# EAGLE design ch340g (EAGLE 9.6.2)
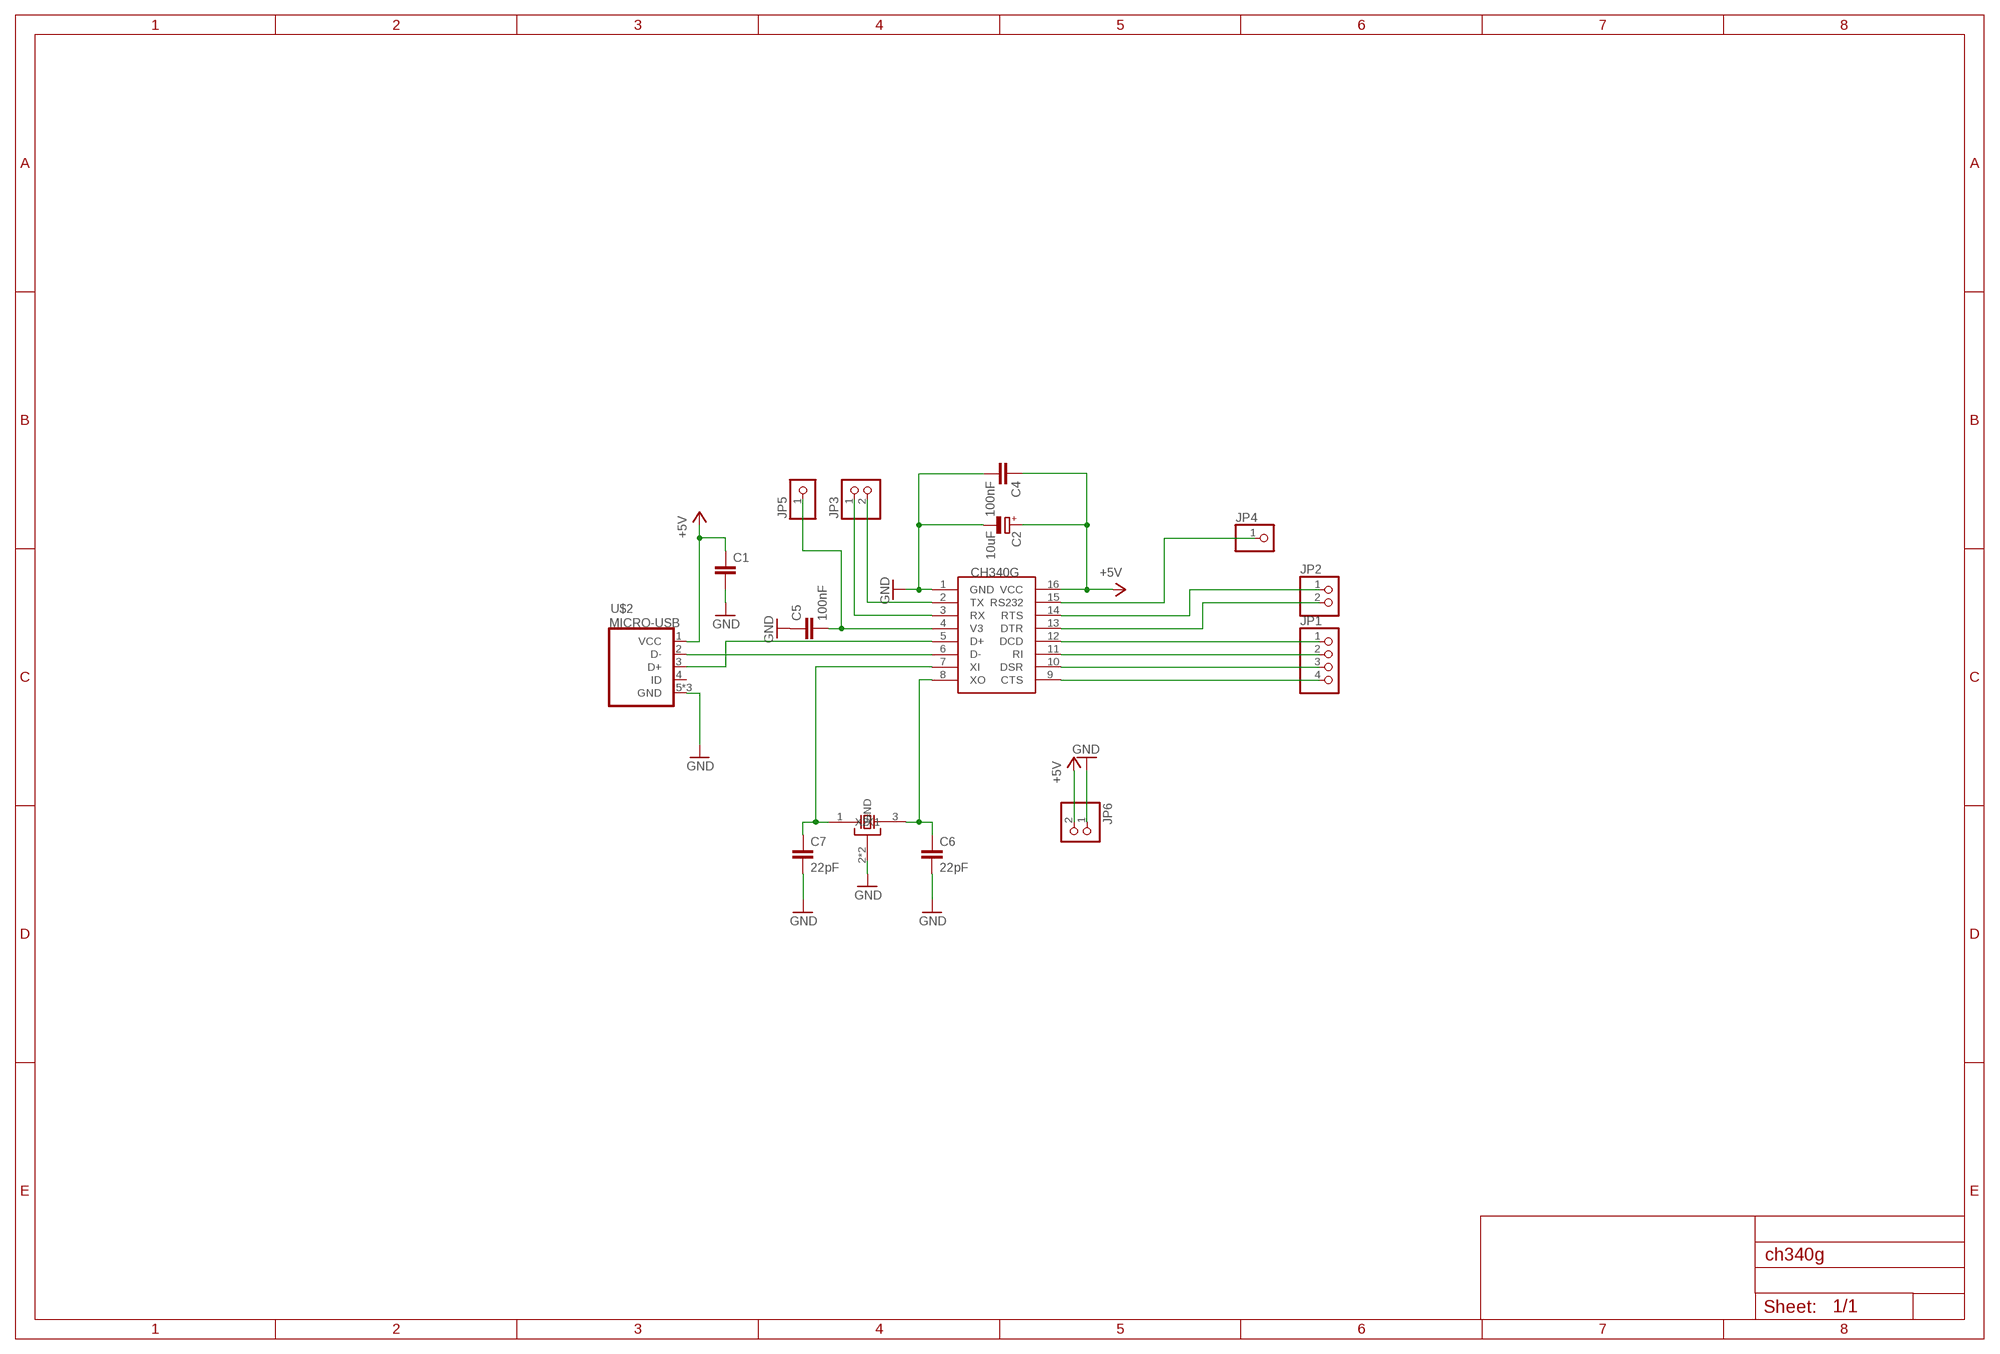
[diagram p0: schematic, sheet 1]

## Parts
C1  C-EUC1206K  [C1206K]
C2  10uF  CPOL-EUSMCA  [SMC_A]
C4  100nF  C-EUC0805  [C0805]
C5  100nF  C-EUC1206K  [C1206K]
C6  22pF  C-EUC0805  [C0805]
C7  22pF  C-EUC0805  [C0805]
JP1  PINHD-1X4  [1X04]
JP2  PINHD-1X2  [1X02]
JP3  PINHD-1X2  [1X02]
JP4  PINHD-1X1  [1X01]
JP5  PINHD-1X1  [1X01]
JP6  PINHD-1X2  [1X02]
U$1  CH340G  [SOIC16]
U$2  MICRO-USB  [MICRO-USB]
U$3  CTS_32X25_SMD  [CTS_32X25]

## Nets
+5V: C1.1 C2.+ C4.1 JP6.2 U$1.16(VCC) U$2.1(VCC)
GND: C1.2 C2.- C4.2 C5.1 C6.2 C7.2 JP6.1 U$1.1(GND) U$2.5(GND) U$2.GND1(GND) U$2.GND2(GND) U$3.2(GND) U$3.4(GND)
N$1: U$1.6(D-) U$2.2(D-)
N$2: U$1.5(D+) U$2.3(D+)
N$3: JP1.1 U$1.12(DCD)
N$4: JP1.2 U$1.11(RI)
N$5: C7.1 U$1.7(XI) U$3.1(X1)
N$6: C6.1 U$1.8(XO) U$3.3(X2)
N$7: JP2.1 U$1.14(RTS)
N$8: JP2.2 U$1.13(DTR)
N$9: JP1.3 U$1.10(DSR)
N$10: JP1.4 U$1.9(CTS)
N$11: JP3.2 U$1.2(TX)
N$12: JP3.1 U$1.3(RX)
N$13: JP4.1 U$1.15(RS232)
N$14: C5.2 JP5.1 U$1.4(V3)
Unconnected: U$2.4(ID)

## Library data of the parts
C1 C4-C7 = rcl:C-EU: CAPACITOR, European symbol; SPICEPREFIX: C
C2 = rcl:CPOL-EU: POLARIZED CAPACITOR, European symbol; SPICEPREFIX: C
JP1 = pinhead:PINHD-1X4: PIN HEADER
JP2 JP3 JP6 = pinhead:PINHD-1X2: PIN HEADER
JP4 JP5 = pinhead:PINHD-1X1: PIN HEADER
U$1 = ch340g:CH340G
U$2 = microusb:MICRO-USB: Micro USB B connector
U$3 = cts_crystal:CTS_32X25_SMD

## Board
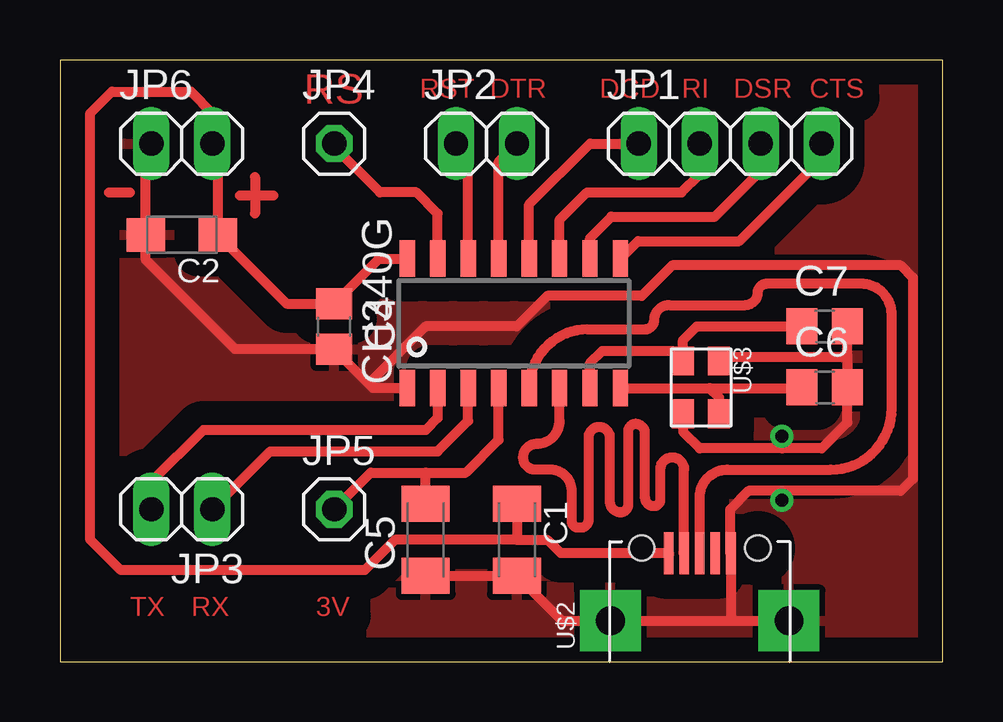
[diagram p1: board, top side]
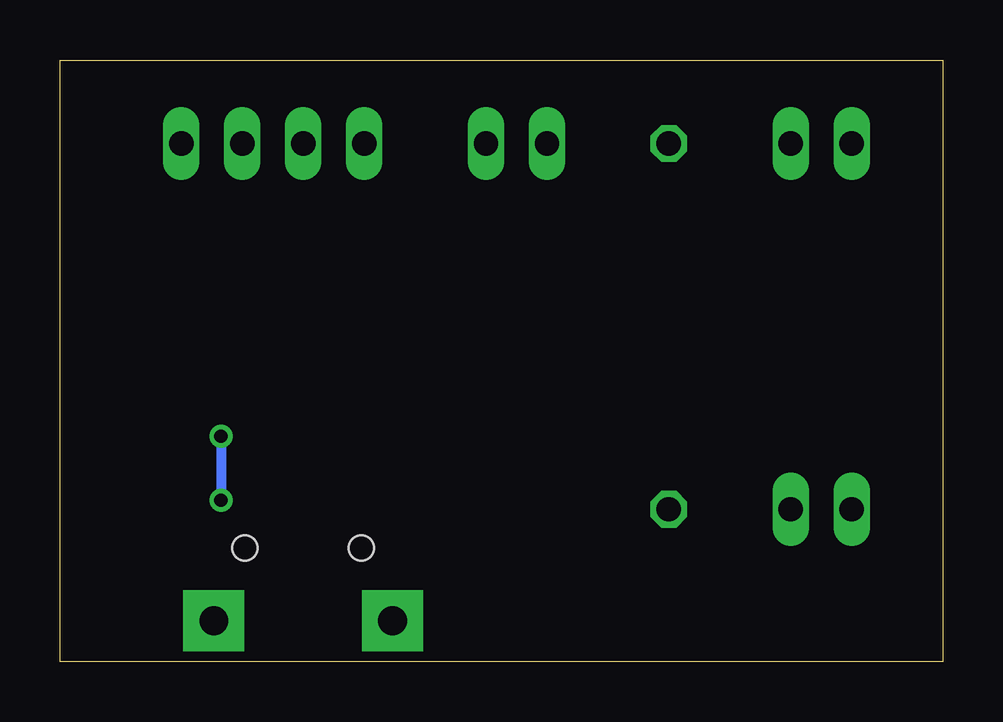
[diagram p2: board, bottom side, seen from below]

Size 36.81 x 25.07 mm. Coordinates in mm from the lower left corner, seen from the top.
Outline: 0,0 36.81,0 36.81,25.07 0,25.07 0,0
Copper layers (1*16): Top 0.035mm / dielectric 1.5mm / Bottom 0.035mm
Design rules "default": minimum track width 6mil, minimum drill 0.35mm, track to track 6mil, track to pad 6mil, pad to pad 6mil, via to via 6mil, smd to smd 6mil, copper to edge 40mil, drill to drill 6mil, minimum pad ring 10mil, minimum via ring 8mil, stop-mask expansion 4mil, vias tented up to drill 0mil, thermal gap 10mil

### Footprints (pad centres in the part's own frame; a part is rotated, then mirrored left to right if it is on the bottom)
C1206K = smd 1.5 x 2: 1 -1.5,0; 2 1.5,0
SMC_A = smd 1.6 x 1.4: + -1.5,0; - 1.5,0
C0805 = smd 1.3 x 1.5: 1 -0.95,0; 2 0.95,0
1X04 = drill 1.016 long: 1 -3.81,0; 2 -1.27,0; 3 1.27,0; 4 3.81,0
1X02 = drill 1.016 long: 1 -1.27,0; 2 1.27,0
1X01 = drill 1.016 octagon: 1 0,0
SOIC16 = smd 0.635 x 1.524: 1 -4.445,-2.695; 2 -3.175,-2.695; 3 -1.905,-2.695; 4 -0.635,-2.695; 5 0.635,-2.695; 6 1.905,-2.695; 7 3.175,-2.695; 8 4.445,-2.695; 9 4.445,2.695; 10 3.175,2.695; 11 1.905,2.695; 12 0.635,2.695; 13 -0.635,2.695; 14 -1.905,2.695; 15 -3.175,2.695; 16 -4.445,2.695
MICRO-USB = smd 0.4 x 1.75: 1 -1.3,4.525; 2 -0.65,4.525; 3 0,4.525; 4 0.65,4.525; 5 1.3,4.525 | drill 1.2 pad 2.54 square: GND1 -3.725,1.7; GND2 3.725,1.7 | hole 1.05: -2.425,4.73; 2.425,4.73
CTS_32X25 = smd 1.2 x 0.9: 1 -1.1,-0.7; 2 1.1,-0.7; 3 1.1,0.8; 4 -1.1,0.8

### Placement (x,y rotation side)
C1  19.05,5.08 270 top
C2  5.08,17.78 180 top
C4  11.43,13.97 270 top
C5  15.24,5.08 90 top
C6  31.88,11.43 0 top
C7  31.88,13.97 0 top
JP1  27.94,21.59 0 top
JP2  17.78,21.59 0 top
JP3  5.08,6.35 180 top
JP4  11.43,21.59 0 top
JP5  11.43,6.35 0 top
JP6  5.08,21.59 0 top
U$1  18.92,14.1 0 top
U$2  26.67,0 0 top
U$3  26.67,11.43 270 top

### Tracks (layer width: path | path; a pad name or v marks a point on that pad's centre or on a via)
+5V
  Top 0.406: C1.1 19.05,5.08 | 19.05,5.08 20.32,5.08 20.88,4.53 U$2.1 25.4,4.5 | 19.05,5.08 13.97,5.08 12.7,3.81 2.54,3.81 1.27,5.08 1.27,22.86 2.16,23.75 5.46,23.75 6.35,22.86 JP6.2 6.58,21.36 C2.+ 9.44,14.92 C4.1 13.3,16.79 U$1.16
GND  (via drill 0.55)
  Top 0.406: U$3.4 27.64,12.7 32.77,12.7 32.83,12.76 | 32.83,12.76 C7.2 | 32.83,12.76 C6.2 32.83,9.97 31.75,8.89 30.1,8.89 | U$3.2 25.97,9.59 26.67,8.89 30.1,8.89 | U$2.5 arc-90 27.94,4.55 | U$1.1 13.05,11.4 12.86,11.59 | 12.86,11.59 C4.2 7.3,13.02 3.58,16.74 C2.- 3.58,21.36 JP6.1 | C5.1 C1.2 20.93,1.7 U$2.GND1 27.94,1.7 | 27.94,1.7 U$2.GND2 | 12.86,11.59 15.24,13.97 19.05,13.97 20.32,15.24 24.26,15.24 25.53,16.51 35.05,16.51 35.56,16 35.56,7.62 35.05,7.11 30.1,7.11 | U$2.5 27.94,4.55 | 27.94,4.55 27.94,6.35 28.7,7.11 30.1,7.11 | U$2.5 27.97,1.73 27.94,1.7 | v30.1,9.4 30.1,8.89 | v30.1,6.73 30.1,7.11
  Bottom 0.406: v30.1,9.4 v30.1,6.73
  pour Top (isolate 1.016): 0,25.4 36.83,25.4 36.83,0 0,0
N$1
  Top 0.406: 25.99,4.56 U$2.2 26.02,8.02 arc90 25.53,8.51 arc90 25.02,8 25.02,6.73 arc-90 24.77,6.48 arc-90 24.38,6.86 24.38,9.53 arc90 24,9.91 arc90 23.69,9.59 23.69,6.54 arc-90 23.37,6.22 arc-90 22.92,6.67 22.92,9.34 arc90 22.48,9.78 arc90 22.04,9.34 22.04,5.91 arc-90 21.72,5.59 21.59,5.59 arc-90 21.34,5.84 21.34,7.11 arc90 20.45,8 19.81,8 arc-90 19.3,8.51 arc-90 19.88,9.08 arc90 20.83,10.03 U$1.6
N$2
  Top 0.406: U$2.3 26.67,6.86 arc-90 27.81,8 32.13,8 arc90 34.67,10.54 34.67,14.48 arc90 33.4,15.75 29.46,15.75 arc90 29.08,15.37 arc-90 28.57,14.86 25.4,14.86 arc90 24.77,14.22 arc-90 24.38,13.84 22,13.84 arc90 U$1.5
N$3
  Top 0.406: U$1.12 19.56,19.05 22.1,21.59 JP1.1
N$4
  Top 0.406: U$1.11 20.83,18.41 21.97,19.56 25.91,19.56 26.67,20.32 JP1.2
N$5
  Top 0.406: U$1.7 22.1,12.45 22.61,12.95 25.55,12.95 U$3.1 25.97,13.4 26.54,13.97 C7.1
N$6
  Top 0.406: U$1.8 27.08,11.4 | U$3.3 27.47,11.01 27.08,11.4 | 27.08,11.4 30.9,11.4 C6.1
N$7
  Top 0.406: U$1.14 17.02,21.08 JP2.1
N$8
  Top 0.406: U$1.13 18.29,20.83 JP2.2
N$9
  Top 0.406: U$1.10 22.1,17.65 22.99,18.54 27.3,18.54 29.21,20.45 JP1.3
N$10
  Top 0.406: U$1.9 24.1,17.53 28.32,17.53 31.75,20.95 JP1.4
N$11
  Top 0.406: U$1.2 15.75,10.16 15.24,9.65 5.97,9.65 3.81,7.49 JP3.2
N$12
  Top 0.406: JP3.1 8.76,8.76 15.75,8.76 17.02,10.03 U$1.3
N$13
  Top 0.406: U$1.15 15.75,18.67 14.86,19.56 13.33,19.56 11.43,21.46 JP4.1
N$14
  Top 0.406: JP5.1 12.95,7.87 15.24,7.87 | U$1.4 18.29,9.24 16.92,7.87 15.24,7.87 | C5.2 15.24,7.87
N$15
  Top 0.406: 7.49,19.43 8.89,19.43
N$16
  Top 0.406: 8.13,20.19 8.13,18.67
N$17
  Top 0.406: 2.03,19.56 2.92,19.56

### Text on the board
Top: RS | RST | DTR | DCD | RI | DSR | CTS | TX | RX | 3V